# EasyEDA Pro project solar_panel_12v.eprj

# Schematic Schematic1
Board Name: Board1; Create Date: 2026-06-06; Page Name: P1; Project Name: solar_panel_12v; Schematic Name: Schematic1; Update Date: 2026-06-05; Company: EasyEDA.com; Page Size: A4; Version: V1.0
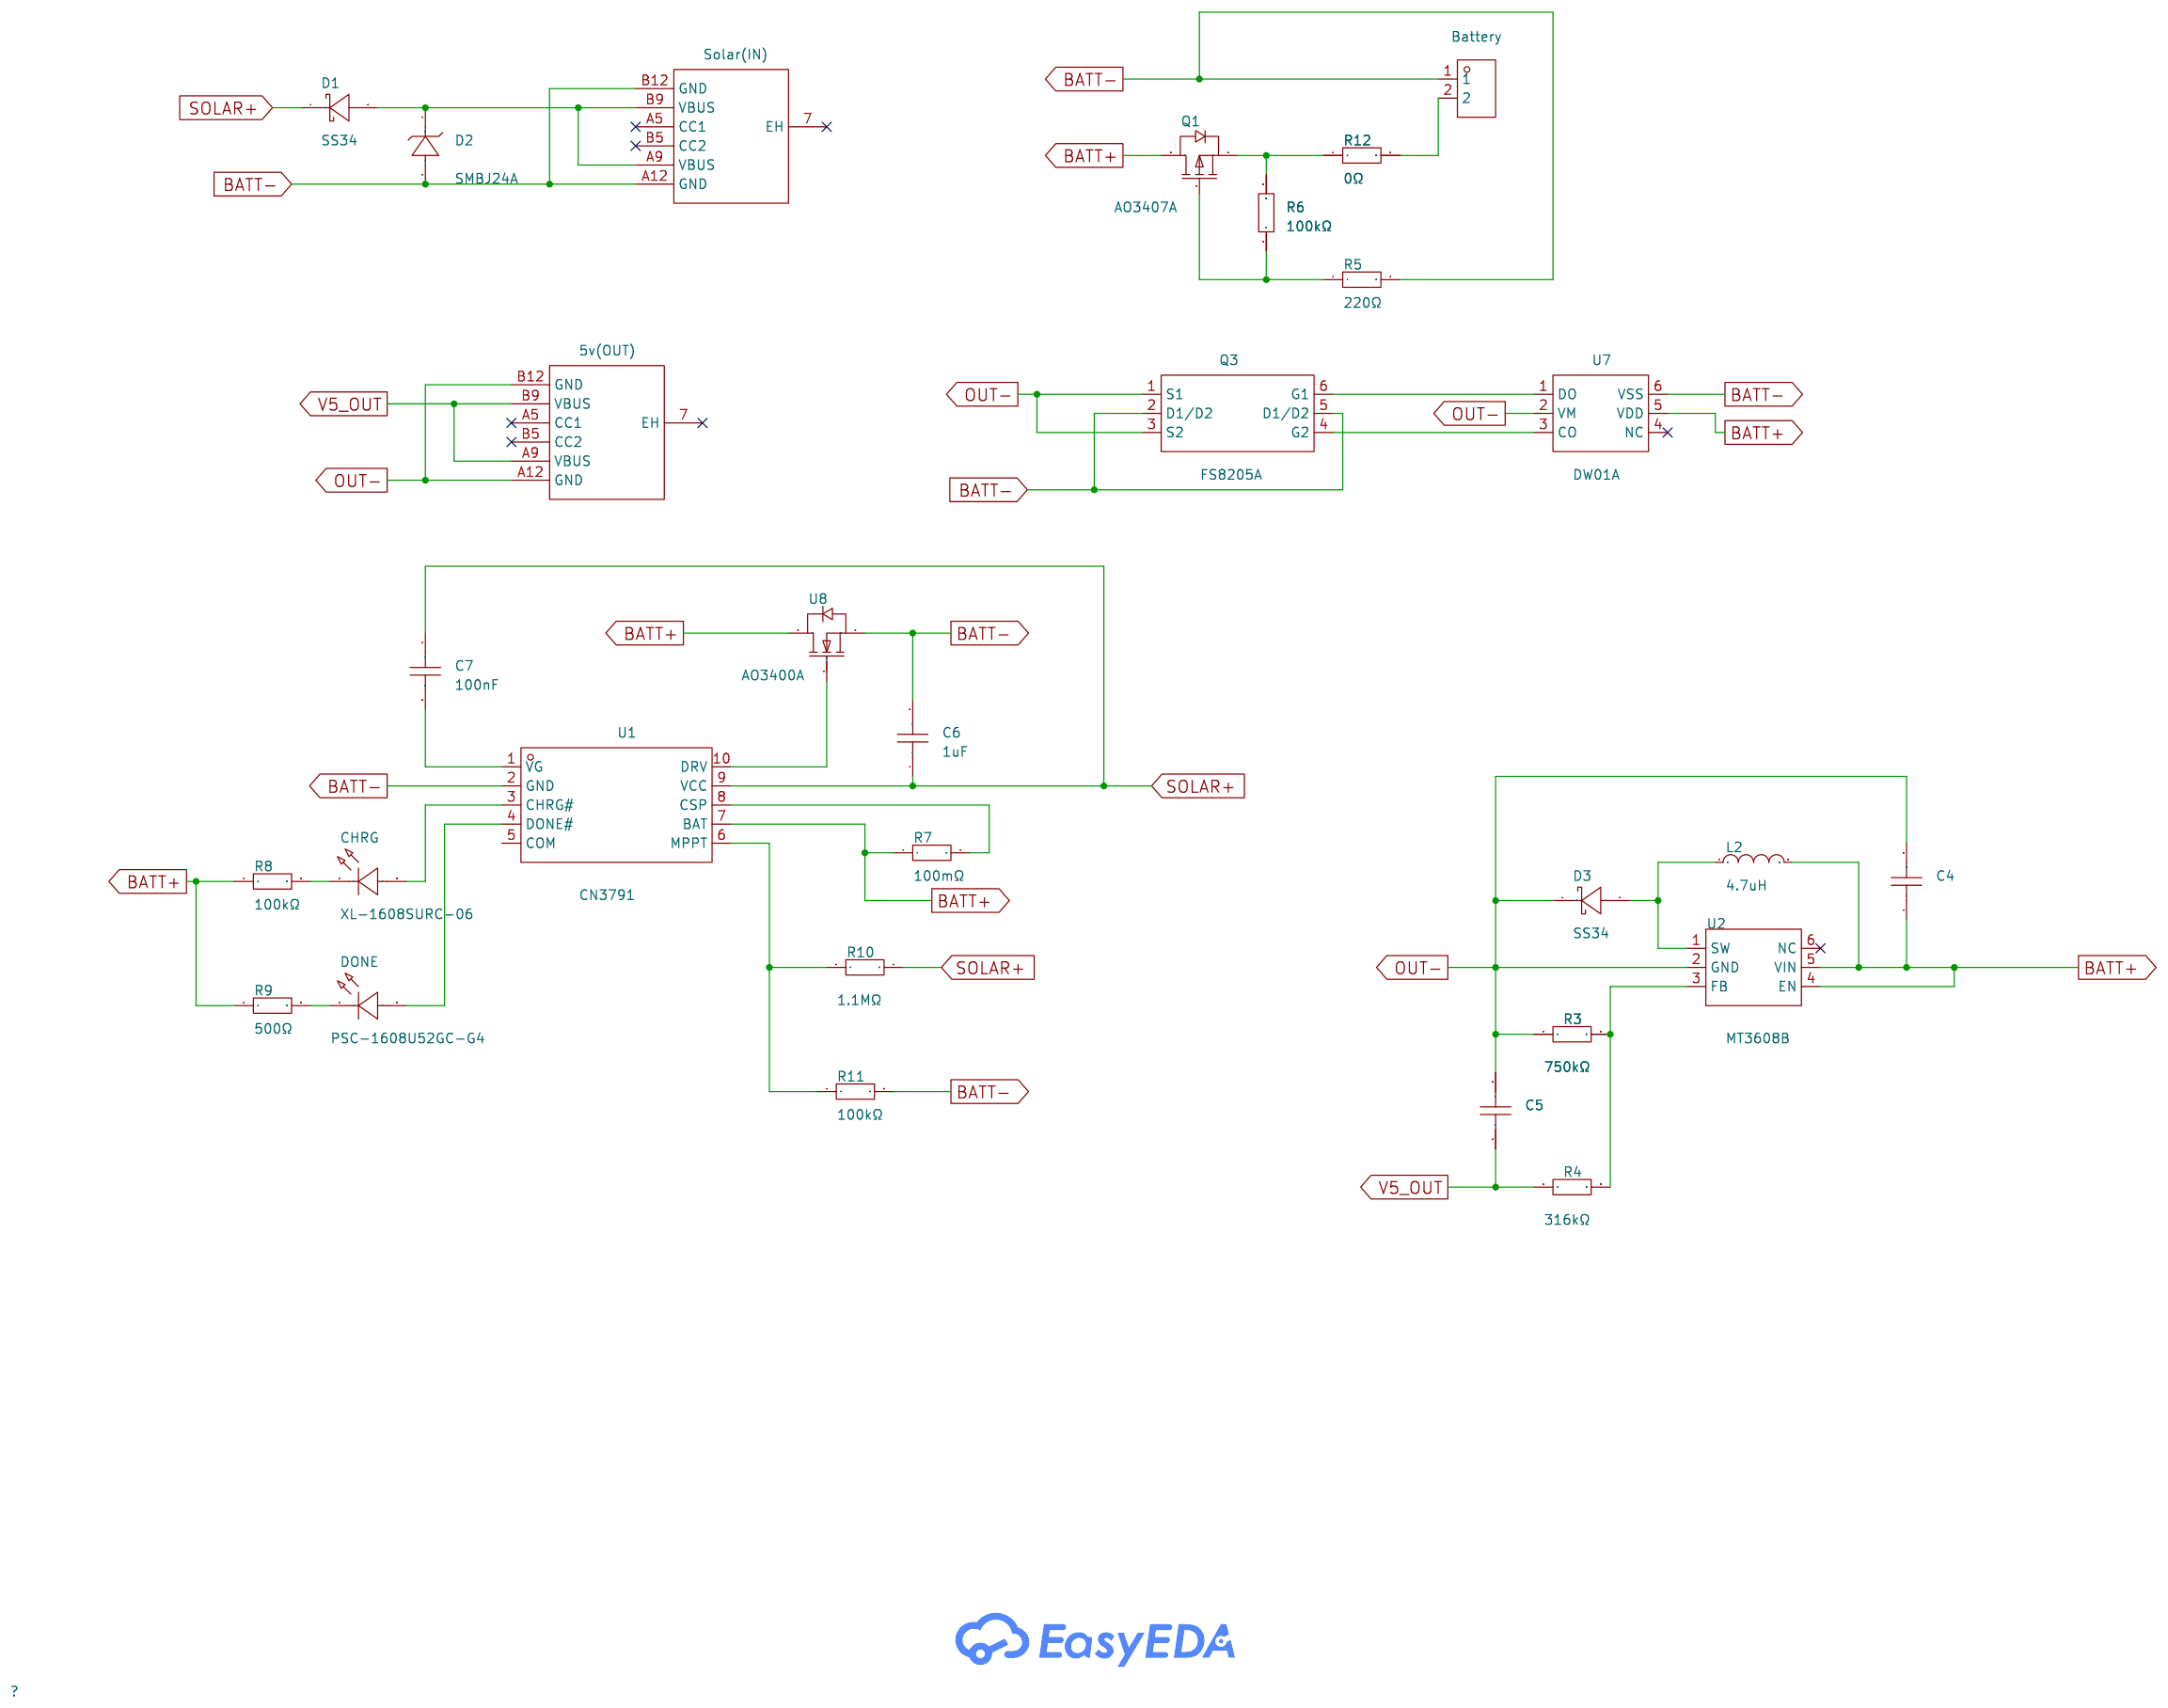
[diagram p0: schematic sheet]

## Parts
5v(OUT)  TYPE-C 6P  [TYPE-C-SMD_TYPE-C-6P_1]
Battery  S2B-PH-SM4-TB(LF)(SN)  [CONN-SMD_P2.00_S2B-PH-SM4-TB-LF-SN]
C4  10uF  [C0603]
C5  10uF  [C0603]
C6  1uF  [C0603]
C7  100nF  [C0603]
CHRG  XL-1608SURC-06  [LED0603-RD_RED]
D1  SS34  [SMA_L4.3-W2.6-LS5.1-RD]
D2  SMBJ24A  [SMB_L4.6-W3.6-LS5.3-RD]
D3  SS34  [SMA_L4.3-W2.6-LS5.1-RD]
DONE  PSC-1608U52GC-G4  [LED0603-RD_GREEN]
L2  4.7uH  [L0805]
Q1  AO3407A  [SOT-23_L2.9-W1.3-P1.90-LS2.4-BR]
Q3  FS8205A  [SOT-23-6_L2.9-W1.6-P0.95-LS2.8-BR]
R3  750kΩ  [R0603]
R4  316kΩ  [R0603]
R5  220Ω  [R0603]
R6  100kΩ  [R0603]
R7  100mΩ  [R1206]
R8  100kΩ  [R0603]
R9  500Ω  [R0805]
R10  1.1MΩ  [R0603]
R11  100kΩ  [R0603]
R12  0Ω  [R1812]
Solar(IN)  TYPE-C 6P  [TYPE-C-SMD_TYPE-C-6P_1]
U1  CN3791  [SSOP-10_L4.9-W3.9-P1.00-LS6.0-BL]
U2  MT3608B  [SOT-23-6_L2.9-W1.6-P0.95-LS2.8-BR]
U7  DW01A  [SOT-23-6_L2.9-W1.6-P0.95-LS2.9-BL]
U8  AO3400A  [SOT-23-3_L2.9-W1.3-P1.90-LS2.4-BR]

## Library data of the parts
5v(OUT) Solar(IN) = TYPE-C 6P: Connector Type:Type-C Protocol Standard:- Gender:Female Mounting Type:Surface Mount, Right Angle Number of Contacts:6P Number of Ports:1 Current Rating-Power:3A Voltage Rating:5V Connect-Disconnect Life:3,000 Cycles Supplementary Features:- Center Height:; LCSC Part Name: 6P卧贴母座; Supplier Part: C456012; Manufacturer: SHOU HAN(首韩); Supplier Footprint: SMD; JLCPCB Part Class: Extended Part; Datasheet: https://item.szlcsc.com/datasheet/TYPE-C%25206P/458819.html; Supplier: LCSC; Connector Type: Type-C; Gender: Female; Mounting Type: Surface Mount, Right Angle; Number of Contacts: 6P; Number of Ports: 1; Current Rating-Power: 3A; Voltage Rating: 5V; Connect-Disconnect Life: 3,000 Cycles; Detection color: Black; Operating Temperature: -40℃~+85℃
Battery = S2B-PH-SM4-TB(LF)(SN): Pins Structure:1x2P Pitch:2mm Mounting Style:Horizontal attachment Reference Series:PH Number of Pins:2P Number of Rows:1 Number of PINs Per Row:2 Row Spacing:- Current Rating (Max):2A Contact Material:Copper alloy Contact Plating:Tin Operating Temperatur; LCSC Part Name: 1x2P 间距:2mm 卧贴 系列:PH; Supplier Part: C295747; Manufacturer: JST; Supplier Footprint: SMD,P=2mm,卧贴; JLCPCB Part Class: Extended Part; Datasheet: https://atta.szlcsc.com/upload/public/pdf/source/20210203/C295747_344B2E64535E381E727D98C302AB61C7.pdf; Supplier: LCSC; Pins Structure: 1x2P; Pitch: 2mm; Mounting Style: Horizontal attachment; Reference Series: PH; Number of Pins: 2P; Number of Rows: 1; Number of PINs Per Row: 2; Current Rating (Max): 2A; Contact Material: Copper alloy; Contact Plating: Tin; Operating Temperature Range: -25℃~+85℃; Rated Voltage (Max): 100V; Plastic Material: PA; Flame Retardant Rating: UL94V-0; Supplementary Features: Auxiliary soldering legs; Colour: Beige; Z-Height of the Board: 5.5mm; X-Length of Bottom Edge on Board (Spacing Line): 7.9mm; Y-Width of Bottom Edge on Board: 8.6mm
C4 C5 = C0603B106M007T: Capacitance:10uF Tolerance:±20% Tolerance:±20% Voltage Rating:6.3V Temperature Coefficient:X5R; LCSC Part Name: 10uF ±20% 6.3V; Supplier Part: C7094065; Manufacturer: IHHEC(禾伸堂); Supplier Footprint: 0603; JLCPCB Part Class: Extended Part; Datasheet: https://item.szlcsc.com/datasheet/C0603B106M007T/8060709.html; Supplier: LCSC; Tolerance: ±20%; Voltage Rating: 6.3V; Temperature Coefficient: X5R
C6 = C0603X105K025T: Capacitance:1uF Tolerance:±10% Tolerance:±10% Voltage Rating:25V Temperature Coefficient:X7R; LCSC Part Name: 1uF ±10% 25V; Supplier Part: C559292; Manufacturer: IHHEC(禾伸堂); Supplier Footprint: 0603; JLCPCB Part Class: Extended Part; Datasheet: https://item.szlcsc.com/datasheet/C0603X105K025T/583174.html; Supplier: LCSC; Tolerance: ±10%; Voltage Rating: 25V; Temperature Coefficient: X7R
C7 = CC0603KRX7R0BB104: Capacitance:100nF Tolerance:±10% Tolerance:±10% Voltage Rating:100V Temperature Coefficient:X7R; LCSC Part Name: 100nF ±10% 100V; Supplier Part: C113803; Manufacturer: YAGEO(国巨); Supplier Footprint: 0603; JLCPCB Part Class: Extended Part; Datasheet: https://item.szlcsc.com/datasheet/CC0603KRX7R0BB104/115039.html; Supplier: LCSC; Tolerance: ±10%; Voltage Rating: 100V; Temperature Coefficient: X7R
CHRG = XL-1608SURC-06: LCSC Part Name: 0603红色贴片式发光二极管; Supplier Part: C965799; Manufacturer: XINGLIGHT(成兴光); Supplier Footprint: 0603; JLCPCB Part Class: Extended Part; Datasheet: https://item.szlcsc.com/datasheet/XL-1608SURC-06/1051408.html; Supplier: LCSC; Lamp Holder Type: 1.6mm x 0.8mm square LED; Illumination Color: Red; Voltage - Forward(Vf): 2.3V; Power(Watts): 50mW; Forward Current: 20mA; Wavelength - Dominant: 620nm~630nm; Peak Wavelength: 625nm; Diode Configuration: Discrete Diode; Lens Color: Water Clear; Luminous Intensity: 225mcd; Viewing Angle: 120°; Mounting Style: Top-mount; Operating Temperature: -40℃~+85℃
D1 D3 = SS34_C52023881: Supplier Part: C52023881; Manufacturer: Hangyu(航昱微); Supplier Footprint: SMA; JLCPCB Part Class: Extended Part; Datasheet: https://item.szlcsc.com/datasheet/SS34/54772671.html; Supplier: LCSC
D2 = SMBJ24A_C5343588: LCSC Part Name: 单向TVS 24V截止 峰值浪涌电流：15.5A; Supplier Part: C5343588; Manufacturer: KUU; Supplier Footprint: SMB; JLCPCB Part Class: Extended Part; Datasheet: https://item.szlcsc.com/datasheet/SMBJ24A/6120740.html; Supplier: LCSC; Polarity: Unidirectional; Reverse Stand-Off Voltage (Vrwm): 24V; Clamping Voltage: 38.9V; Peak Pulse Current (Ipp): 15.5A; Peak Pulse Power Dissipation (Ppp): 600W; Voltage - Breakdown: 26.7V; Reverse Leakage Current (Ir): 1uA; Operating Temperature: -55℃~+150℃; Type: TVS
DONE = PSC-1608U52GC-G4: LCSC Part Name: 钻孔1608低亮绿灯; Supplier Part: C22371297; Manufacturer: HONGLITRONIC(鸿利光电); Supplier Footprint: 0603; JLCPCB Part Class: Extended Part; Datasheet: https://item.szlcsc.com/datasheet/PSC-1608U52GC-G4/23857064.html; Supplier: LCSC; Illumination Color: Green; Voltage - Forward(Vf): 3.1V; Power(Watts): 66mW; Forward Current: 10mA; Wavelength - Dominant: 517nm~527nm; Diode Configuration: Discrete Diode; Lens Color: Water Clear; Luminous Intensity: 780mcd; Viewing Angle: 130°; Operating Temperature: -40℃~+85℃
L2 = CPY201209T-4R7M-NP: Inductance:4.7uH Tolerance:±20% Tolerance:±20% Current Rating:- Current - Saturation (Isat):- DC Resistance(DCR):- Q @ Frequency:- Frequency - Self Resonant:- Ratings:-; LCSC Part Name: 4.7uH ±20%; Supplier Part: C285965; Manufacturer: Chilisin(奇力新); Supplier Footprint: 0805; JLCPCB Part Class: Extended Part; Datasheet: https://item.szlcsc.com/datasheet/CPY201209T-4R7M-NP/271270.html; Supplier: LCSC; Tolerance: ±20%
Q1 = AO3407A_C347478: LCSC Part Name: 1个P沟道 耐压:30V 电流:4.2A; Supplier Part: C347478; Manufacturer: UMW(友台半导体); Supplier Footprint: SOT-23; JLCPCB Part Class: Extended Part; Datasheet: https://item.szlcsc.com/datasheet/AO3407A/324138.html; Supplier: LCSC; Number: 1 P-Channel; Drain to Source Voltage: 30V; Current - Continuous Drain(Id): 4.2A; RDS(on): 37mΩ@10V；52mΩ@4.5V; Pd - Power Dissipation: 1.4W; Gate Threshold Voltage (Vgs(th)): 1.8V@250uA; Gate Charge(Qg): 14.3nC@4.5V; Input Capacitance(Ciss): 700pF; Reverse Transfer Capacitance (Crss@Vds): 75pF
Q3 = FS8205A_C908265: Type:2 N-Channel Drain to Source Voltage:20V Current - Continuous Drain(Id): RDS(on):18mΩ@4.5V,6A Pd - Power Dissipation:1.5W Gate Threshold Voltage (Vgs(th)@Id):1.2V Gate Charge(Qg):11nC@4.5V Input Capacitance(Ciss@Vds):800pF@8V Reverse Transfer Capacita; LCSC Part Name: 2个N沟道 耐压:20V 电流:6A; Supplier Part: C908265; Manufacturer: FUXINSEMI(富芯森美); Supplier Footprint: SOT-23-6L; JLCPCB Part Class: Extended Part; Datasheet: https://atta.szlcsc.com/upload/public/pdf/source/20201027/C908265_C6F1A5E0FB14735EF799FEF607A99450.pdf; Supplier: LCSC; Type: 2 N-Channel; Drain to Source Voltage: 20V; RDS(on): 18mΩ@4.5V,6A; Pd - Power Dissipation: 1.5W; Gate Threshold Voltage (Vgs(th)@Id): 1.2V; Gate Charge(Qg): 11nC@4.5V; Input Capacitance(Ciss@Vds): 800pF@8V; Reverse Transfer Capacitance (Crss@Vds): 125pF@8V; Operating Temperature: -55℃~+150℃@(Tj)
R3 = CR0603FA7503G: Type:Thick Film Resistor Resistance:750kΩ Tolerance:±1% Tolerance:±1% Power(Watts):100mW Voltage-Supply(Max):50V Temperature Coefficient:±100ppm/℃ Temperature Coefficient:±100ppm/℃ Operating Temperature:-55℃~+125℃ Operating Temperature:-55℃~+125℃; LCSC Part Name: 厚膜电阻 750kΩ ±1% 100mW; Supplier Part: C101186; Manufacturer: LIZ(丽智电子); Supplier Footprint: 0603; JLCPCB Part Class: Extended Part; Datasheet: https://item.szlcsc.com/datasheet/CR0603FA7503G/102401.html; Supplier: LCSC; Type: Thick Film Resistor; Tolerance: ±1%; Power(Watts): 100mW; Voltage-Supply(Max): 50V; Temperature Coefficient: ±100ppm/℃; Operating Temperature: -55℃~+125℃
R4 = FRC0603F3163TS: Type:Thick Film Resistor Resistance:316kΩ Tolerance:±1% Tolerance:±1% Power(Watts):100mW Voltage-Supply(Max):75V Temperature Coefficient:±100ppm/℃ Temperature Coefficient:±100ppm/℃ Operating Temperature:-55℃~+155℃ Operating Temperature:-55℃~+155℃; LCSC Part Name: 316kΩ ±1% 100mW 厚膜电阻; Supplier Part: C2998125; Manufacturer: FOJAN(富捷); Supplier Footprint: 0603; JLCPCB Part Class: Extended Part; Supplier: LCSC; Type: Thick Film Resistor; Tolerance: ±1%; Power(Watts): 100mW; Voltage-Supply(Max): 75V; Temperature Coefficient: ±100ppm/℃; Operating Temperature: -55℃~+155℃
R5 = SCR0603J220R: Type:Thick Film Resistors Resistance: Tolerance:±5% Tolerance:±5% Power(Watts): Overload Voltage (Max): Operating Temperature Range:-55℃~+155℃ Operating Temperature Range:-55℃~+155℃; LCSC Part Name: 厚膜电阻 220Ω ±5% 100mW; Supplier Part: C3017752; Manufacturer: VO(翔胜); Supplier Footprint: 0603; JLCPCB Part Class: Extended Part; Datasheet: https://atta.szlcsc.com/upload/public/pdf/source/20220513/247AF9639BA21CF93567DC289CCC6A22.pdf; Supplier: LCSC; Type: Thick Film Resistors; Tolerance: ±5%; Operating Temperature Range: -55℃~+155℃
R6 R8 = FCR0603F100K: Type:Thick Film Resistors Resistance: Tolerance:±1% Tolerance:±1% Power(Watts): Overload Voltage (Max): Operating Temperature Range:-55℃~+155℃ Operating Temperature Range:-55℃~+155℃; LCSC Part Name: 100K ±1%; Supplier Part: C5913165; Manufacturer: VO(翔胜); Supplier Footprint: 0603; JLCPCB Part Class: Extended Part; Datasheet: https://atta.szlcsc.com/upload/public/pdf/source/20230428/98B65D379E9BA4CF2A9223D1647B01B6.pdf; Supplier: LCSC; Type: Thick Film Resistors; Tolerance: ±1%; Operating Temperature Range: -55℃~+155℃
R7 = FRM121WFR100TM: Type:Current Sense Resistor Resistance:100mΩ Tolerance:±1% Tolerance:±1% Voltage Rating:- Power(Watts):1W Current Rating:- Temperature Coefficient:±50ppm/℃ Temperature Coefficient:±50ppm/℃ Mounting Type:-; LCSC Part Name: 100mΩ ±1% 1W; Supplier Part: C7467250; Manufacturer: FOJAN(富捷); Supplier Footprint: 1206; JLCPCB Part Class: Extended Part; Datasheet: https://item.szlcsc.com/datasheet/FRM121WFR100TM/8513850.html; Supplier: LCSC; Type: Current Sense Resistor; Tolerance: ±1%; Power(Watts): 1W; Temperature Coefficient: ±50ppm/℃
R9 = ARG05FTC5000: Type:Thin Film Resistor Resistance:500Ω Tolerance:±1% Tolerance:±1% Power(Watts):125mW Voltage-Supply(Max):150V Temperature Coefficient:±25ppm/℃ Temperature Coefficient:±25ppm/℃ Operating Temperature:-55℃~+155℃ Operating Temperature:-55℃~+155℃; LCSC Part Name: 薄膜电阻 500Ω ±1% 125mW; Supplier Part: C2828857; Manufacturer: Viking(光颉); Supplier Footprint: 0805; JLCPCB Part Class: Extended Part; Datasheet: https://item.szlcsc.com/datasheet/ARG05FTC5000/2977326.html; Supplier: LCSC; Type: Thin Film Resistor; Tolerance: ±1%; Power(Watts): 125mW; Voltage-Supply(Max): 150V; Temperature Coefficient: ±25ppm/℃; Operating Temperature: -55℃~+155℃
R10 = FRC0603J115TS: Type:Thick Film Resistor Resistance:1.1MΩ Tolerance:±5% Tolerance:±5% Power(Watts):100mW Voltage-Supply(Max):75V Temperature Coefficient:±100ppm/℃ Temperature Coefficient:±100ppm/℃ Operating Temperature:-55℃~+155℃ Operating Temperature:-55℃~+155℃; LCSC Part Name: 1.1MΩ ±5% 100mW 厚膜电阻; Supplier Part: C2930018; Manufacturer: FOJAN(富捷); Supplier Footprint: 0603; JLCPCB Part Class: Extended Part; Datasheet: https://item.szlcsc.com/datasheet/FRC0603J115TS/3266951.html; Supplier: LCSC; Type: Thick Film Resistor; Tolerance: ±5%; Power(Watts): 100mW; Voltage-Supply(Max): 75V; Temperature Coefficient: ±100ppm/℃; Operating Temperature: -55℃~+155℃
R11 = CR0603J100KP05Z: Type:Thick Film Resistor Resistance:100kΩ Tolerance:±5% Tolerance:±5% Power(Watts):100mW Voltage-Supply(Max):75V Temperature Coefficient:±100ppm/℃ Temperature Coefficient:±100ppm/℃ Operating Temperature:-55℃~+155℃ Operating Temperature:-55℃~+155℃; LCSC Part Name: 厚膜电阻 100kΩ ±5% 100mW; Supplier Part: C881354; Manufacturer: EVER OHMS(天二科技); Supplier Footprint: 0603; JLCPCB Part Class: Extended Part; Datasheet: https://item.szlcsc.com/datasheet/CR0603J100KP05Z/944269.html; Supplier: LCSC; Type: Thick Film Resistor; Tolerance: ±5%; Power(Watts): 100mW; Voltage-Supply(Max): 75V; Temperature Coefficient: ±100ppm/℃; Operating Temperature: -55℃~+155℃
R12 = FRC1812P000 TS: Type:Thick Film Resistor Resistance:0Ω Tolerance:±5% Tolerance:±5% Power(Watts):750mW Voltage-Supply(Max):200V Operating Temperature:-55℃~+155℃ Operating Temperature:-55℃~+155℃; LCSC Part Name: 0Ω ±5% 750mW 厚膜电阻; Supplier Part: C2907555; Manufacturer: FOJAN(富捷); Supplier Footprint: 1812; JLCPCB Part Class: Extended Part; Supplier: LCSC; Type: Thick Film Resistor; Tolerance: ±5%; Power(Watts): 750mW; Voltage-Supply(Max): 200V; Operating Temperature: -55℃~+155℃
U1 = CN3791: LCSC Part Name: 具有太阳能电池最大功率点跟踪功能的4A单节锂电池充电管理集成电路; Supplier Part: C154992; Manufacturer: CONSONANCE(上海如韵); Supplier Footprint: SSOP-10-150mil; JLCPCB Part Class: Extended Part; Datasheet: https://item.szlcsc.com/datasheet/CN3791/166334.html; Supplier: LCSC; The Chip Type: Charging IC; Voltage - Supply: 4.5V~28V; Charge Current - Max: 4A; Charging Saturation Voltage: 4.2V; Type of Battery: Lithium Battery; Number of Cells: 1; Operating Temperature: -40℃~+85℃; Battery Temperature Detection: Not supported; Supply Current (Iq): 15uA; Features: Constant voltage charging；Constant current charging；Charge termination；Automatic recharge；Soft start；Programmable charging current；Overvoltage protection；Undervoltage lockout；Trickle charging
U2 = MT3608B: LCSC Part Name: 升压型 4A 2.5V~24V; Supplier Part: C19189893; Manufacturer: 西安航天民芯; Supplier Footprint: SOT-23-6; JLCPCB Part Class: Extended Part; Datasheet: https://item.szlcsc.com/datasheet/MT3608B/20421435.html; Supplier: LCSC; Function: Boost; Voltage - Supply: 2.5V~24V; Output Current: 4A; Frequency - Switching: 1.2MHz; Operating Temperature: -40℃~+85℃; Synchronous Rectifier: No; Number of Outputs: 1; Topology: Boost; Quiescent Current: 70uA; Switch tube (built-in/external): Built-in; Output Type: Adjustable
U7 = DW01A_C42380662: The Chip Type:Protection IC Voltage - Supply:1.5V~10V Voltage - Supply:1.5V~10V Charge Current - Max:- Charging Saturation Voltage:- End-Off Voltage:2.5V Type of Battery:Lithium Battery Number of Cells:1 Number of Cells:1 Operating Temperature:-40℃~+85℃ O; LCSC Part Name: SOT23-6塑封封装锂电池保护IC; Supplier Part: C42380662; Manufacturer: Slkor(萨科微); Supplier Footprint: SOT-23-6; JLCPCB Part Class: Extended Part; Datasheet: https://item.szlcsc.com/datasheet/DW01A/44291671.html; Supplier: LCSC; The Chip Type: Protection IC; Voltage - Supply: 1.5V~10V; End-Off Voltage: 2.5V; Type of Battery: Lithium Battery; Number of Cells: 1; Operating Temperature: -40℃~+85℃; Battery Temperature Detection: Not supported; 0V Battery Charge: Support; Supply Current (Iq): 700nA
U8 = AO3400A_C49195711: LCSC Part Name: N沟道 耐压:30V 电流:5.8A; Supplier Part: C49195711; Manufacturer: YONGYUTAI(永裕泰); Supplier Footprint: SOT-23; JLCPCB Part Class: Extended Part; Datasheet: https://item.szlcsc.com/datasheet/AO3400A/51597059.html; Supplier: LCSC; Drain to Source Voltage: 30V; Current - Continuous Drain(Id): 5.8A; RDS(on): 19mΩ@10V; Pd - Power Dissipation: 1.36W; Gate Threshold Voltage (Vgs(th)): 900mV@250uA; Gate Charge(Qg): 7.5nC@4.5V; Input Capacitance(Ciss): 702pF; Reverse Transfer Capacitance (Crss@Vds): 52pF; Operating Temperature: -55℃~+150℃; Type: N-Channel; Output Capacitance(Coss): 66pF

## Nets
V5_OUT: 5v(OUT).A9(VBUS) 5v(OUT).B9(VBUS) C5.1 R4.1
BATT+: C4.1 L2.2 Q1.3(D) R7.1 R8.1 R9.1 U1.7(BAT) U2.4(EN) U2.5(VIN) U7.5(VDD) U8.3(D)
BATT-: Battery.1 C6.2 D2.2(A) Q3.2(D1/D2) Q3.5(D1/D2) R5.2 R11.2 Solar(IN).A12(GND) Solar(IN).B12(GND) U1.2(GND) U7.6(VSS) U8.2(S)
OUT-: 5v(OUT).A12(GND) 5v(OUT).B12(GND) C4.2 C5.2 D3.1(C) Q3.1(S1) Q3.3(S2) R3.1 U2.2(GND) U7.2(VM)
SOLAR+: C6.1 C7.1 D1.1(C) R10.2 U1.9(VCC)
$1N964: Q1.1(G) R5.1 R6.1
$1N1126: Q3.6(G1) U7.1(DO)
$1N1132: Q3.4(G2) U7.3(CO)
$1N1461: D3.2(A) L2.1 U2.1(SW)
$1N1463: R3.2 R4.2 U2.3(FB)
$1N2000: R7.2 U1.8(CSP)
$1N2267: CHRG.2(A) U1.3(CHRG#)
$1N2306: CHRG.1(K) R8.2
$1N2442: DONE.1(K) R9.2
$1N2446: DONE.2(A) U1.4(DONE#)
$1N2471: D1.2(A) D2.1(C) Solar(IN).A9(VBUS) Solar(IN).B9(VBUS)
$1N2563: R10.1 R11.1 U1.6(MPPT)
$1N2756: U1.10(DRV) U8.1(G)
$1N2836: C7.2 U1.1(VG)
$1N2967: Q1.2(S) R6.2 R12.1
$1N2971: Battery.2 R12.2

Not connected (* = marked no-connect by the designer): 5v(OUT) 7(EH)* A5(CC1)* B5(CC2)*; Solar(IN) 7(EH)* A5(CC1)* B5(CC2)*; U1 5(COM); U2 6(NC)*; U7 4(NC)*

# Board PCB1
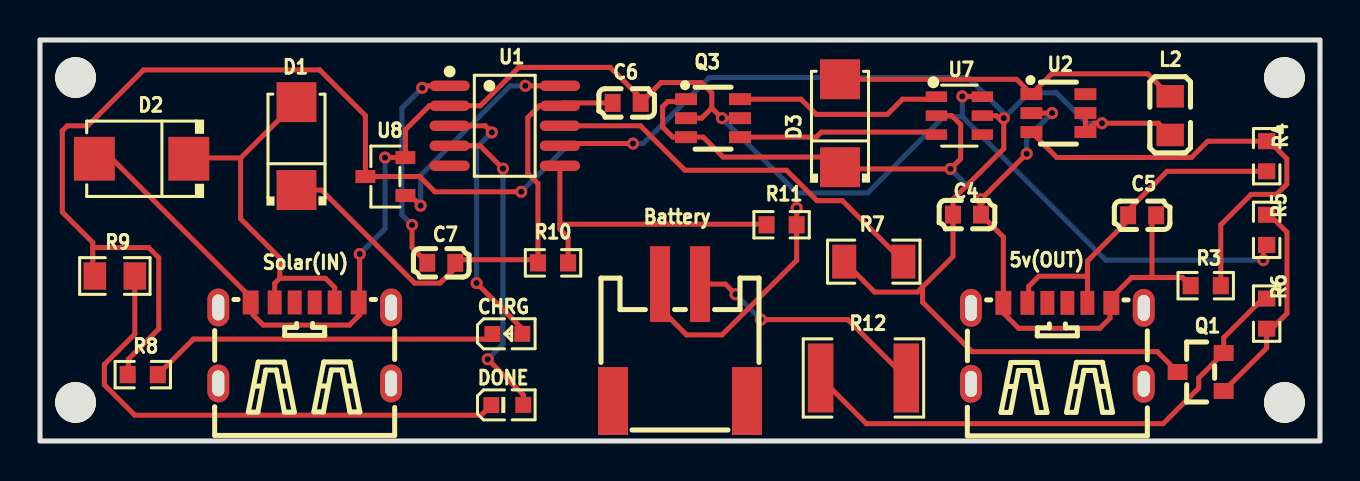
[diagram p1: board, top side]
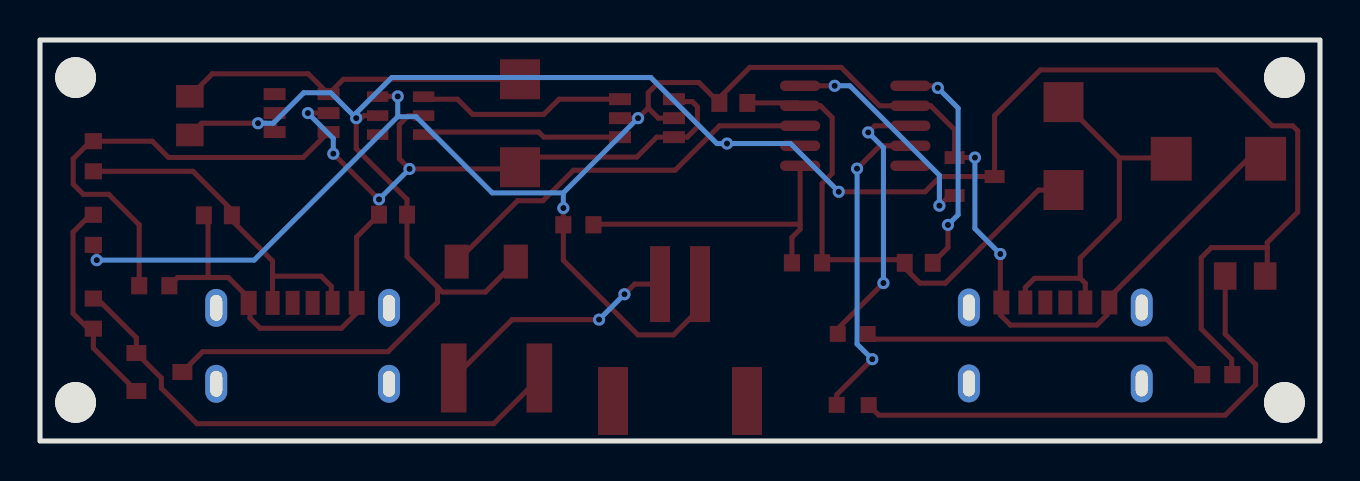
[diagram p2: board, bottom side, seen from below]

Outline 64.01 x 20.07 mm; copper layers: Top Layer, Bottom Layer. Coordinates in mm from the lower left corner of the outline.
Outline path: rectangle 0,20.07 64.01,0
Stack: Top Layer 0.035mm / Dielectric1 1.51mm FR4 er 4.5 / Bottom Layer 0.035mm

## Design rules (mm)
template: Custom Config
spacing copperThickness1oz (default): track to track 0.4, other pairs 0.152 to 0.3
spacing copperThickness2oz: track to track 0.203, other pairs 0.152 to 0.3
track width copperThickness1oz (default): min 0.127, default 0.254, max 2.54
track width copperThickness2oz: min 0.203, default 0.254, max 2.54
differential pair differentialPair (default): width min 0.127, default 0.254, max 2.54; gap min 0.152, default 0.152
via viaSize (default): diameter min 0.5, default 0.61, max 10; hole min 0.3, default 0.305, max 6.3

## Placement (name value [footprint] x y rotation side)
5v(OUT)  TYPE-C 6P  [TYPE-C-SMD_TYPE-C-6P_1]  50.87 4.89 0 top
Battery  S2B-PH-SM4-TB(LF)(SN)  [CONN-SMD_P2.00_S2B-PH-SM4-TB-LF-SN]  32 4.93 0 top
C4  10uF  [C0603]  46.36 11.33 0 top
C5  10uF  [C0603]  55.11 11.3 0 top
C6  1uF  [C0603]  29.34 16.92 0 top
C7  100nF  [C0603]  20.07 8.92 180 top
CHRG  XL-1608SURC-06  [LED0603-RD_RED]  23.37 5.36 0 top
D1  SS34  [SMA_L4.3-W2.6-LS5.1-RD]  12.83 14.76 90 top
D2  SMBJ24A  [SMB_L4.6-W3.6-LS5.3-RD]  5.08 14.12 180 top
D3  SS34  [SMA_L4.3-W2.6-LS5.1-RD]  40.01 15.9 90 top
DONE  PSC-1608U52GC-G4  [LED0603-RD_GREEN]  23.37 1.8 0 top
L2  4.7uH  [L0805]  56.52 16.28 270 top
NOREF  -  [Pad_e36]  62.23 18.19 0 top
NOREF#2  -  [Pad_e41]  62.23 1.93 0 top
NOREF#3  -  [Pad_e37]  1.78 1.93 0 top
NOREF#4  -  [Pad_e34]  1.78 18.19 0 top
Q1  AO3407A  [SOT-23_L2.9-W1.3-P1.90-LS2.4-BR]  58.04 3.45 0 top
Q3  FS8205A  [SOT-23-6_L2.9-W1.6-P0.95-LS2.8-BR]  33.66 16.15 180 top
R3  750kΩ  [R0603]  58.29 7.77 0 top
R4  316kΩ  [R0603]  61.34 14.25 90 top
R5  220Ω  [R0603]  61.34 10.57 270 top
R6  100kΩ  [R0603]  61.34 6.38 90 top
R7  100mΩ  [R1206]  41.69 8.98 0 top
R8  100kΩ  [R0603]  5.14 3.32 0 top
R9  500Ω  [R0805]  3.74 8.26 0 top
R10  1.1MΩ  [R0603]  25.65 8.92 180 top
R11  100kΩ  [R0603]  37.08 10.82 0 top
R12  0Ω  [R1812]  41.18 3.15 0 top
Solar(IN)  TYPE-C 6P  [TYPE-C-SMD_TYPE-C-6P_1]  13.24 4.91 0 top
U1  CN3791  [SSOP-10_L4.9-W3.9-P1.00-LS6.0-BL]  23.24 15.77 270 top
U2  MT3608B  [SOT-23-6_L2.9-W1.6-P0.95-LS2.8-BR]  50.93 16.41 180 top
U7  DW01A  [SOT-23-6_L2.9-W1.6-P0.95-LS2.9-BL]  45.97 16.28 270 top
U8  AO3400A  [SOT-23-3_L2.9-W1.3-P1.90-LS2.4-BR]  17.27 13.23 0 top

## Footprints (pads in the part's own frame, mm; a bottom-side part is the same pattern mirrored in y, then rotated)
C0603
  rect 0.8x0.9 smd: 1(-0.7,0) 2(0.7,0)
CONN-SMD_P2.00_S2B-PH-SM4-TB-LF-SN
  rect 1x3.8 smd: 1(-1,2.925) 2(1,2.925)
  rect 1.5x3.4 smd: 3(3.35,-2.925) 4(-3.35,-2.925)
L0805
  rect 1.133x1.377 smd: 1(-0.966,0) 2(0.966,0)
LED0603-RD_GREEN
  rect 0.8x0.8 smd: 1(-0.799,-0.004) 2(0.799,0.004)
LED0603-RD_RED
  rect 0.8x0.8 smd: 1(-0.749,-0.004) 2(0.749,0.004)
Pad_e34
  round 2.032 hole 2.032: 1(0,0)
Pad_e36
  round 2.032 hole 2.032: 2(0,0)
Pad_e37
  round 2.032 hole 2.032: 3(0,0)
Pad_e41
  round 2.032 hole 2.032: 4(0,0)
R0603
  rect 0.806x0.864 smd: 1(-0.753,0) 2(0.753,0)
R0805
  rect 1.133x1.377 smd: 1(-1,0) 2(1,0)
R1206
  rect 1.208x1.701 smd: 1(-1.479,0) 2(1.479,0)
R1812
  rect 1.282x3.456 smd: 1(-2.141,0) 2(2.141,0)
SMA_L4.3-W2.6-LS5.1-RD
  rect 2x2 smd: 1(-2.2,0) 2(2.2,0)
SMB_L4.6-W3.6-LS5.3-RD
  rect 2.047x2.192 smd: 1(-2.361,0) 2(2.361,0)
SOT-23-3_L2.9-W1.3-P1.90-LS2.4-BR
  rect 1x0.65 smd: 1(1,-0.95) 2(1,0.95) 3(-1,0)
SOT-23-6_L2.9-W1.6-P0.95-LS2.8-BR
  rect 1.1x0.6 smd: 1(1.35,-0.95) 2(1.35,0) 3(1.35,0.95) 4(-1.35,0.95) 5(-1.35,0) 6(-1.35,-0.95)
SOT-23-6_L2.9-W1.6-P0.95-LS2.9-BL
  rect 0.532x1.072 smd: 1(-0.95,-1.149) 2(0,-1.149) 3(0.95,-1.149) 4(0.95,1.149) 5(0,1.149) 6(-0.95,1.149)
SOT-23_L2.9-W1.3-P1.90-LS2.4-BR
  rect 1x0.8 smd: 1(1.15,-0.95) 2(1.15,0.95) 3(-1.15,0)
SSOP-10_L4.9-W3.9-P1.00-LS6.0-BL
  oval 0.525x2.014 smd: 1(-2,-2.756) 2(-1,-2.756) 3(0,-2.756) 4(1,-2.756) 5(2,-2.756) 6(2,2.756) 7(1,2.756) 8(0,2.756) 9(-1,2.756) 10(-2,2.756)
TYPE-C-SMD_TYPE-C-6P_1
  oval 1.1x1.9 hole 0.6x1.3: 7(-4.32,1.775) 7(-4.32,-2.025) 7(4.32,1.775) 7(4.32,-2.025)
  rect 0.7x1.2 smd: A5(-0.5,2.025) A9(1.5,2.025) B5(0.5,2.025) B9(-1.5,2.025)
  rect 0.8x1.2 smd: A12(2.7,2.025) B12(-2.7,2.025)

## Nets
As in the schematic.

Pads without a net: 5v(OUT) 7 A5 B5; Battery 3 4; NOREF 2; NOREF#2 4; NOREF#3 3; NOREF#4 1; Solar(IN) 7 A5 B5; U1 5; U2 6; U7 4

## Via types
v1: diameter 0.61, hole 0.305, Top Layer to Bottom Layer, 24 vias

## Routing (per net, layer and track width the routed paths; a pad name or vN(x,y) marks a point on that pad's centre or on a via; arc(x,y) is an arc through that point)
V5_OUT: length 17.2
  Top Layer w0.254: 52.38,8.25 52.38,6.92 5v(OUT).A9 ; 52.38,8.25 52.38,9.01 54.41,11.04 54.41,11.55 56.36,13.5 R4.1 ; 52.38,8.25 49.95,8.25 49.44,7.74 49.44,6.98 5v(OUT).B9
BATT+: length 120.3
  Top Layer w0.254: Q1.3 55.87,4.47 46.61,4.47 44.13,6.94 44.13,7.71 ; 48.2,15.9 47.81,16.28 U7.5 ; 48.2,15.9 v1(48.2,16.15) ; 48.2,15.9 48.2,14.63 45.66,12.09 C4.1 45.66,9.23 44.13,7.71 ; U2.5 U2.4 52.72,15.9 v1(53.11,15.9) 55.93,15.9 L2.2 ; R9.1 2.64,8.36 2.64,9.68 ; v1(24.07,12.47) 19.75,12.47 18.98,13.23 U8.3 16.27,16.28 13.99,18.57 5.18,18.57 2.38,15.77 1.37,15.77 1.11,15.52 1.11,11.46 2.64,9.93 2.64,9.68 ; 44.13,7.71 43.88,7.45 41.74,7.45 R7.1 ; R8.1 4.42,3.35 4.42,4.09 5.94,5.61 5.94,9.17 5.43,9.68 2.64,9.68 ; v1(29.65,14.88) 26.11,14.88 U1.7
  Bottom Layer w0.254: v1(53.11,15.9) 52.34,15.9 50.82,17.42 49.47,17.42 v1(48.2,16.15) 48.2,16.41 46.42,18.19 33.46,18.19 30.16,14.88 v1(29.65,14.88) 26.48,14.88 v1(24.07,12.47)
BATT-: length 99.8
  Top Layer w0.254: 33.59,16.66 v1(34.1,16.15) Q3.5 ; 33.59,16.66 33.08,16.15 32.3,16.15 ; 33.59,16.66 33.59,17.42 33.08,17.93 31.05,17.93 C6.2 30.04,17.17 28.51,18.69 23.94,18.69 22.02,16.77 U1.2 19.47,16.77 18.27,15.58 U8.2 v1(17.26,14.18) ; v1(37.84,11.66) R11.2 37.84,9.04 34.11,5.31 32.33,5.31 31.06,6.58 31.06,7.8 Battery.1 ; U7.6 47.11,17.24 v1(46.12,17.24) ; v1(15.99,9.36) 15.99,6.98 ; 15.99,6.98 Solar(IN).A12 ; 15.99,6.98 15.99,6.31 15.48,5.8 11.16,5.8 10.65,6.31 10.65,6.82 Solar(IN).B12 10.54,7.19 3.68,14.04 2.8,14.04 D2.2 ; v1(61.17,9.05) 61.17,9.64 R5.2
  Bottom Layer w0.254: v1(17.26,14.18) 17.26,10.63 v1(15.99,9.36) ; 37.84,12.42 v1(37.84,11.66) ; 37.84,12.42 41.39,12.42 45.2,16.23 46.12,16.23 ; 37.84,12.42 v1(34.1,16.15) ; 46.12,16.23 53.3,9.05 v1(61.17,9.05) ; 46.12,16.23 v1(46.12,17.24)
OUT-: length 51.2
  Top Layer w0.254: R3.1 57.13,8.18 55.61,8.18 ; v1(49.34,14.38) v1(47.05,12.09) C4.2 48.17,10.21 5v(OUT).B12 48.17,6.4 48.94,5.64 53,5.64 53.51,6.15 53.51,6.85 5v(OUT).A12 53.57,7.17 54.59,8.18 55.61,8.18 ; 55.61,8.18 55.61,11.09 C5.2 ; v1(50.61,16.41) U2.2 ; U7.2 45.59,16.28 46.04,15.83 46.04,14.12 v1(45.53,13.61) 40.09,13.61 D3.1 39.5,14.21 34.16,14.21 33.17,15.2 31.64,15.2 31.14,15.71 31.14,16.73 31.39,16.98 32.18,16.98 32.3,17.1
  Bottom Layer w0.254: v1(47.05,12.09) v1(45.53,13.61) ; v1(50.61,16.41) 49.34,15.14 v1(49.34,14.38)
SOLAR+: length 26.7
  Top Layer w0.254: 24.9,9.07 24.9,12.88 24.39,13.39 24.39,16.18 24.98,16.77 U1.9 26.14,16.92 C6.1 ; 24.9,9.07 20.92,9.07 C7.1 20.77,8.66 20,7.9 18.73,7.9 14.08,12.56 D1.1 ; 24.9,9.07 R10.2
$1N964: length 10.8
  Top Layer w0.254: R5.1 61.45,11.21 61.6,11.21 62.36,10.45 62.36,6.38 61.6,5.62 R6.1 61.34,4.66 Q1.1
$1N1126: length 10.5
  Top Layer w0.254: Q3.6 38.05,17.1 38.82,16.34 42.37,16.34 43.13,17.1 44.7,17.1 U7.1
$1N1132: length 10
  Top Layer w0.254: Q3.4 38.82,15.2 39.07,15.46 44.7,15.46 U7.3
$1N1461: length 17.7
  Top Layer w0.254: D3.2 48.83,18.1 U2.1 50.59,18.37 55.39,18.37 L2.1
$1N1463: length 22.5
  Top Layer w0.254: U2.3 50.85,14.19 57.58,14.19 58.4,15 R4.2 61.46,14.88 61.59,14.88 62.35,14.12 62.35,12.85 61.84,12.34 60.57,12.34 59.05,10.82 R3.2
$1N2000: length 20
  Top Layer w0.254: U1.8 30.03,15.77 32.25,13.55 37.33,13.55 38.85,12.02 40.12,12.02 R7.2
$1N2267: length 13.6
  Top Layer w0.254: U1.3 22.26,15.77 v1(22.59,15.44) ; v1(21.83,7.9) 24.12,5.62 CHRG.2
  Bottom Layer w0.254: v1(22.59,15.44) 21.83,14.68 v1(21.83,7.9)
$1N2306: length 17.6
  Top Layer w0.254: CHRG.1 22.36,5.1 7.67,5.1 R8.2
$1N2442: length 26.3
  Top Layer w0.254: DONE.1 22.06,1.29 4.74,1.29 3.22,2.82 3.22,3.83 4.74,5.36 R9.2
$1N2446: length 16
  Top Layer w0.254: v1(22.39,4.09) 24.17,2.31 DONE.2 ; U1.4 22.01,14.77 v1(23.15,13.63)
  Bottom Layer w0.254: v1(23.15,13.63) 23.15,4.85 v1(22.39,4.09)
$1N2471: length 18.4
  Top Layer w0.254: 11.99,8.14 11.74,7.89 Solar(IN).B9 ; 11.99,8.14 14.28,8.14 14.74,7.68 Solar(IN).A9 ; 11.99,8.14 11.99,9.16 10.03,11.12 10.03,14.16 ; 10.03,14.16 7.48,14.16 D2.1 ; 10.03,14.16 D1.2
$1N2563: length 15.4
  Top Layer w0.254: R10.1 26.41,10.19 26,10.59 26,10.85 ; 26,10.85 36.3,10.85 R11.1 ; 26,10.85 U1.6
$1N2756: length 11.3
  Top Layer w0.254: U8.1 18.53,12.28 v1(19.03,11.78) ; v1(24.27,17.77) U1.10
  Bottom Layer w0.254: v1(24.27,17.77) 23.51,17.77 19.03,13.3 v1(19.03,11.78)
$1N2836: length 11.1
  Top Layer w0.254: v1(19.11,17.67) 19.21,17.77 U1.1 ; v1(18.6,10.81) 18.6,9.68 C7.2
  Bottom Layer w0.254: v1(18.6,10.81) 18.1,11.32 18.1,16.65 v1(19.11,17.67)
$1N2967: length 26.6
  Top Layer w0.254: 39.04,3.15 41.32,0.87 56.16,0.87 57.94,2.65 57.94,3.15 Q1.2 59.19,5.17 61.15,7.13 R6.2
$1N2971: length 12.3
  Top Layer w0.254: Battery.2 34.27,7.85 v1(34.78,7.34) ; R12.2 40.4,6.07 v1(36.05,6.07)
  Bottom Layer w0.254: v1(34.78,7.34) v1(36.05,6.07)
